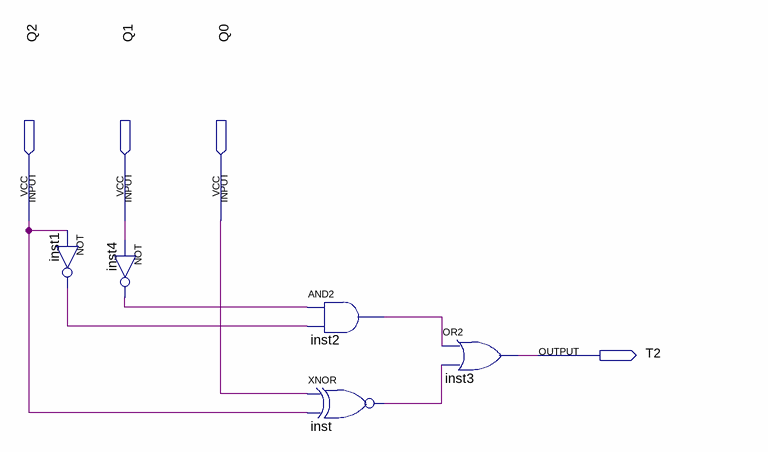
[diagram p0: schematic sheet]
// Quartus schematic T2.bdf as structural Verilog: 5 symbols, 4 pins
module T2 (
  input  Q2,
  input  Q1,
  input  Q0,
  output T2
);

  wire inst1_out, inst2_out, inst4_out, inst_out;

  not inst1 (inst1_out, Q2);
  not inst4 (inst4_out, Q1);
  and inst2 (inst2_out, inst4_out, inst1_out);
  xnor inst (inst_out, Q0, Q2);
  or inst3 (T2, inst2_out, inst_out);
endmodule
